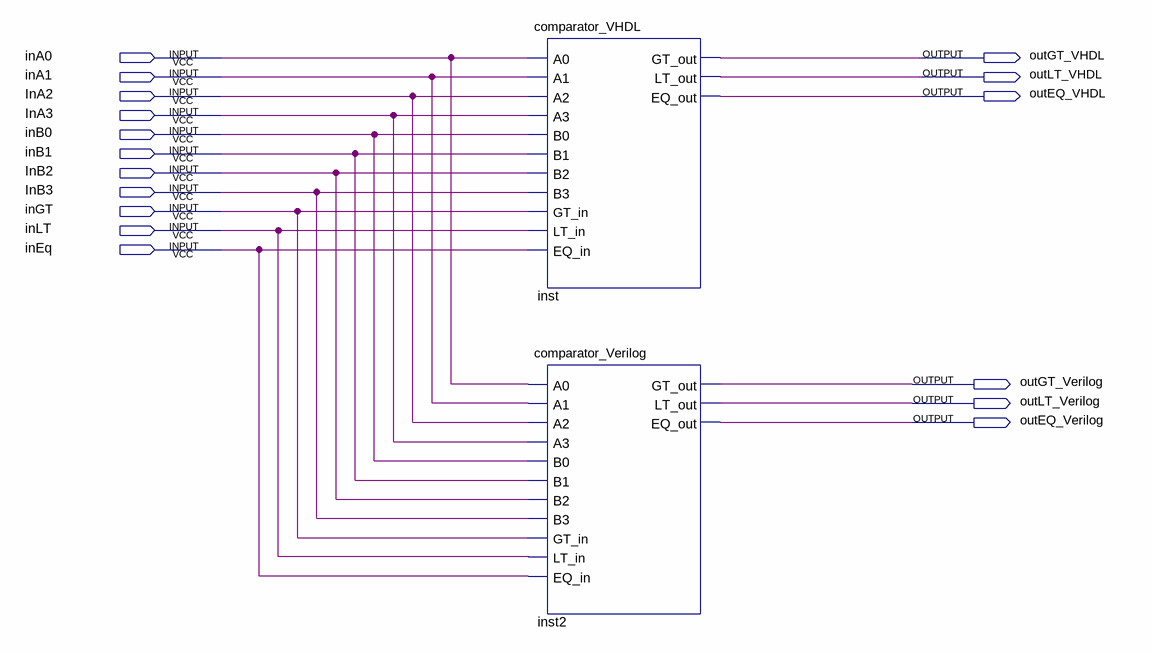
[diagram p0: schematic sheet]
// Quartus schematic lab6_digital_comparator.bdf as structural Verilog: 2 symbols, 17 pins
module lab6_digital_comparator (
  input  inA0,
  input  inA1,
  input  InA2,
  input  InA3,
  input  inB0,
  input  inB1,
  input  InB2,
  input  InB3,
  input  inGT,
  input  inLT,
  input  inEq,
  output outGT_VHDL,
  output outLT_VHDL,
  output outEQ_VHDL,
  output outGT_Verilog,
  output outLT_Verilog,
  output outEQ_Verilog
);

  comparator_VHDL inst (
    .A0(inA0), .A1(inA1), .A2(InA2), .A3(InA3), .B0(inB0), .B1(inB1), .B2(InB2), .B3(InB3), .GT_in(inGT),
    .LT_in(inLT), .EQ_in(inEq), .GT_out(outGT_VHDL), .LT_out(outLT_VHDL), .EQ_out(outEQ_VHDL));
  comparator_Verilog inst2 (
    .A0(inA0), .A1(inA1), .A2(InA2), .A3(InA3), .B0(inB0), .B1(inB1), .B2(InB2), .B3(InB3), .GT_in(inGT),
    .LT_in(inLT), .EQ_in(inEq), .GT_out(outGT_Verilog), .LT_out(outLT_Verilog), .EQ_out(outEQ_Verilog));
endmodule
